# Altium schematic sheet power.SchDoc: BioGAP WULPUS-pro shield
size A3; DrawnBy: IIS; Revision: 1.0.0; SheetNumber: 7; SheetTotal: 8
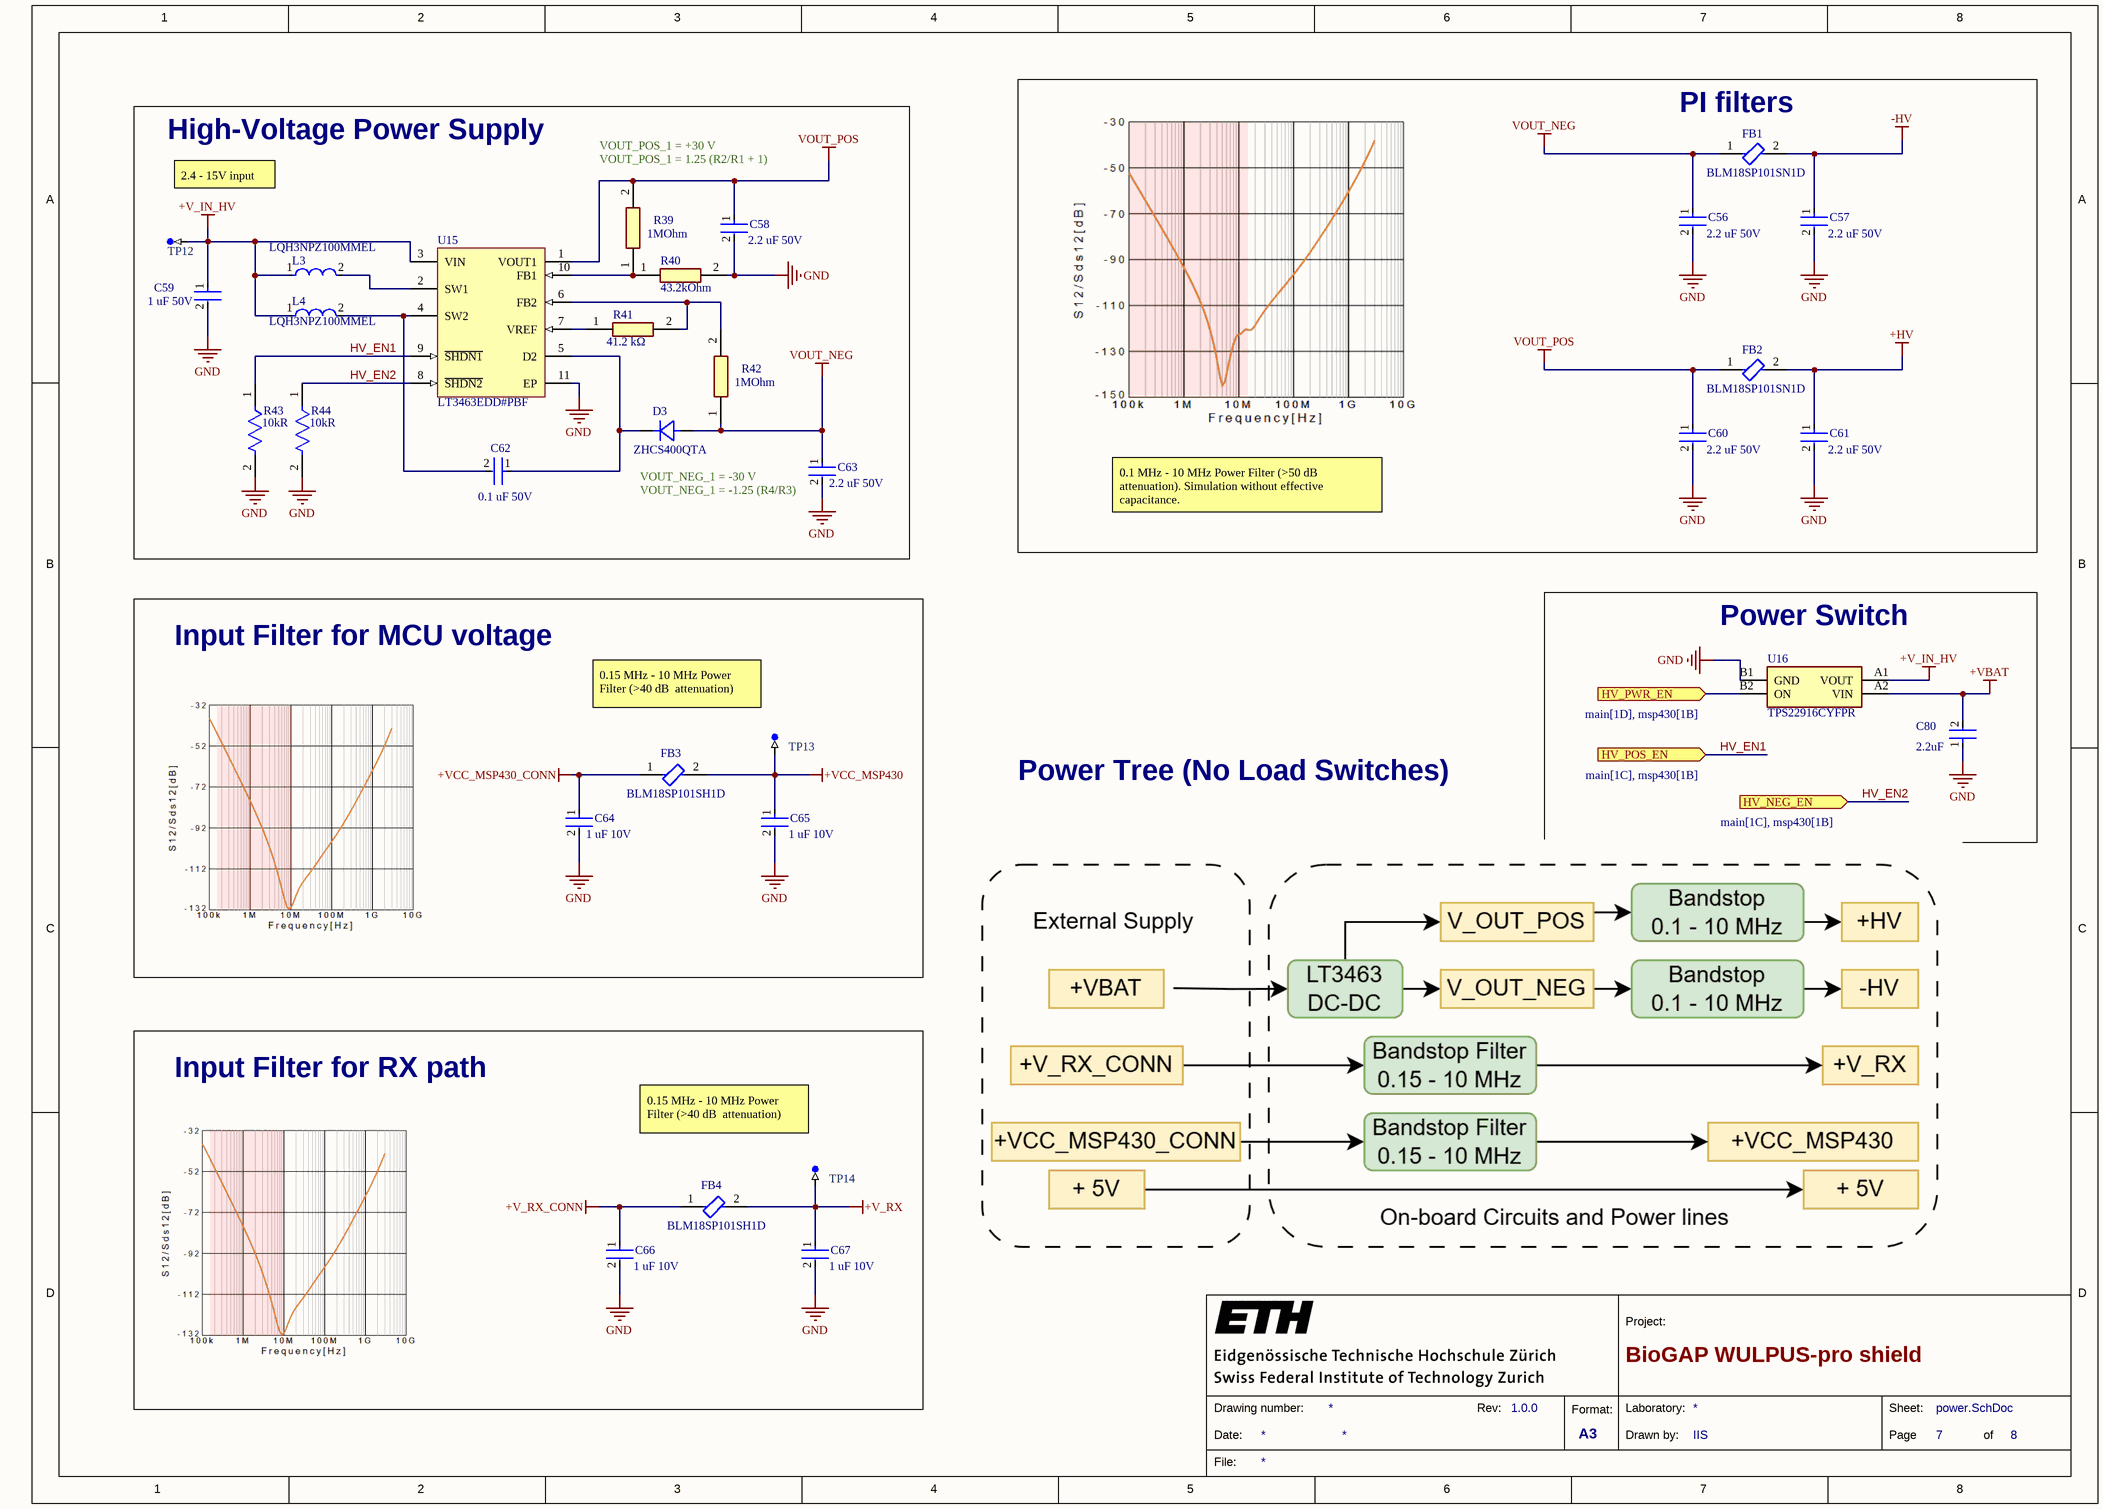
[diagram p0: power.SchDoc]

## Parts
C56  Capacitance: 2.2 uF 50V  [FP-GRM188-0_2-IPC_B]  (hidden comment: GRM188R61H225ME11D)
C57  Capacitance: 2.2 uF 50V  [FP-GRM188-0_2-IPC_B]  (hidden comment: GRM188R61H225ME11D)
C58  Capacitance: 2.2 uF 50V  [FP-GRM188-0_2-IPC_B]  (hidden comment: GRM188R61H225ME11D)
C59  Capacitance: 1 uF 50V  [FP-GCM21B-0_15-IPC_C]  (hidden comment: GCM21BR71H105KA03L)
C60  Capacitance: 2.2 uF 50V  [FP-GRM188-0_2-IPC_B]  (hidden comment: GRM188R61H225ME11D)
C61  Capacitance: 2.2 uF 50V  [FP-GRM188-0_2-IPC_B]  (hidden comment: GRM188R61H225ME11D)
C62  Capacitance: 0.1 uF 50V  [FP-GRM155-0_05-MFG]  (hidden comment: GRM155C71H104KE19D)
C63  Capacitance: 2.2 uF 50V  [FP-GRM188-0_2-IPC_B]  (hidden comment: GRM188R61H225ME11D)
C64  Cap: 1 uF 10V  [FP-GRM155-0_1-IPC_C]  (hidden comment: GRM155Z71A105KE01D)
C65  Cap: 1 uF 10V  [FP-GRM155-0_1-IPC_C]  (hidden comment: GRM155Z71A105KE01D)
C66  Cap: 1 uF 10V  [FP-GRM155-0_1-IPC_C]  (hidden comment: GRM155Z71A105KE01D)
C67  Cap: 1 uF 10V  [FP-GRM155-0_1-IPC_C]  (hidden comment: GRM155Z71A105KE01D)
C80  Capacitance: 2.2uF  [FP-C1005-050-0_15-0_1-MFG]  (hidden comment: C1005X7S1A225K050BC)
D3  ZHCS400QTA  [DIODE_SOD323_DIO]
FB1  BLM18SP101SN1D  [FP-BLM18-0_15-t0_8-MFG]
FB2  BLM18SP101SN1D  [FP-BLM18-0_15-t0_8-MFG]
FB3  BLM18SP101SH1D  [FP-BLM18-0_15-t0_8-MFG]
FB4  BLM18SP101SH1D  [FP-BLM18-0_15-t0_8-MFG]
L3  LQH3NPZ100MMEL  [FP-LQH3NPH_ME-MFG]
L4  LQH3NPZ100MMEL  [FP-LQH3NPH_ME-MFG]
R39  Resistance: 1MOhm  [ERJ2RKD1004X]  (hidden comment: ERJ-2RKF1004X)
R40  Resistance: 43.2kOhm  [ERJ2RKD1004X]  (hidden comment: ERJ-2RKF4322X)
R41  Resistance: 41.2 kΩ  [ERJ2RKD1004X]  (hidden comment: ERJ-2RKF4122X)
R42  Resistance: 1MOhm  [ERJ2RKD1004X]  (hidden comment: ERJ-2RKF1004X)
R43  Resistance: 10kR  [FP-CRCW0402-e3-IPC_B]  (hidden comment: CRCW040210K0JNED)
R44  Resistance: 10kR  [FP-CRCW0402-e3-IPC_B]  (hidden comment: CRCW040210K0JNED)
TP12  TP-SM-C-100  [TP-SM-C-100]  (value not drawn)  (no BOM)
TP13  TP-SM-C-100  [TP-SM-C-100]  (value not drawn)  (no BOM)
TP14  TP-SM-C-100  [TP-SM-C-100]  (value not drawn)  (no BOM)
U15  LT3463EDD#PBF  [LT-DD-10_V]
U16  TPS22916CYFPR  [BGA4C40P2X2_78X78X50]

## Blocks framed on the sheet
High-Voltage Power Supply: C58 C59 C62 C63 D3 L3 L4 R39-R44 TP12 U15
PI filters: C56 C57 C60 C61 FB1 FB2
Input Filter for MCU voltage: C64 C65 FB3 TP13
Power Switch: C80 U16
Input Filter for RX path: C66 C67 FB4 TP14

## Ports
HV_NEG_EN (in, see main[1C], msp430[1B]), HV_POS_EN (in, see main[1C], msp430[1B]), HV_PWR_EN (in, see main[1D], msp430[1B])

## Nets
+HV: C61.1 FB2.2
+V_IN_HV: C59.1 L3.1 L4.1 TP12.1 U15.3(VIN) U16.A1(VOUT)
+V_RX: C67.1 FB4.2 TP14.1
+V_RX_CONN: C66.1 FB4.1
+VBAT: C80.2 U16.A2(VIN)
+VCC_MSP430: C65.1 FB3.2 TP13.1
+VCC_MSP430_CONN: C64.1 FB3.1
-HV: C57.1 FB1.2
GND: C56.2 C57.2 C58.2 C59.2 C60.2 C61.2 C63.2 C64.2 C65.2 C66.2 C67.2 C80.1 R40.2 R43.2 R44.2 U15.11(EP) U16.B1(GND)
VOUT_NEG: C56.1 C63.1 D3.2 FB1.1 R42.1
VOUT_POS: C58.1 C60.1 FB2.1 R39.2 U15.1(VOUT1)
HV_EN1: R43.1 U15.9(~{SHDN1}) ; port HV_POS_EN
HV_EN2: R44.1 U15.8(~{SHDN2}) ; port HV_NEG_EN
HV_PWR_EN: U16.B2(ON) ; port HV_PWR_EN
NetC62_1: C62.1 D3.1 U15.5(D2)
NetC62_2: C62.2 L4.2 U15.4(SW2)
NetL3_2: L3.2 U15.2(SW1)
NetR39_1: R39.1 R40.1 U15.10(FB1)
NetR41_1: R41.1 U15.7(VREF)
NetR41_2: R41.2 R42.2 U15.6(FB2)

## Notes on the sheet
- 2.4 - 15V input
- VOUT_POS_1 = 1.25 (R2/R1 + 1)
- VOUT_POS_1 = +30 V
- (near C63) VOUT_NEG_1 = -1.25 (R4/R3)
- (near D3) VOUT_NEG_1 = -30 V
- 0.1 MHz - 10 MHz Power Filter (>50 dB  attenuation). Simulation without effective capacitance.
- (near TP13) 0.15 MHz - 10 MHz Power Filter (>40 dB  attenuation)
- Power Tree (No Load Switches)
- (near TP14) 0.15 MHz - 10 MHz Power Filter (>40 dB  attenuation)
- 1
- 2
- 3
- 4
- 5
- 6
- 7
- 8
- A
- B
- C
- D
- Project:
- Date:
- Drawing number:
- Rev:
- Format:
- A3
- Drawn by:
- Laboratory:
- Page
- Sheet:
- of
- File:

## Library data of the parts
C56-C58 C60 C61 C63 = CMP-06035-000704-1: Voltage Rating (DC): 50V; Dielectric: X5R; Tolerance: 20%; Weight: 0.000222oz; Min Operating Temperature: -55°C; Case Code (Imperial): 0603; Thickness: 0.039inch; Height: 0.8mm; Termination: SMD/SMT; Resistor Type: Ceramic; Case/Package: 0603; Package Quantity: 4000; Length: 0.063inch; Lead Free: Lead Free; Max Operating Temperature: 85°C; Packaging: Tape and Reel; Width: 0.031inch; Voltage Rating: 50V; Mount: Surface Mount; Case Code (Metric): 1608
C59 = CMP-2007-03354-2: Voltage Rating (DC): 50V; Dielectric: X7R; Tolerance: 10%; Min Operating Temperature: -55°C; Length: 2mm; Package Quantity: 3000; Case Code (Metric): 2012; Max Operating Temperature: 125°C; Termination: SMD/SMT; Thickness: 0.055inch; Ratings: AEC-Q200; Voltage Rating: 50V; Lead Free: Lead Free; Width: 0.049inch; Mount: Surface Mount; Case/Package: 0805; Case Code (Imperial): 0805; Radiation Hardening: No; Height: 1.25mm; Depth: 1.2mm; Packaging: Tape and Reel; Weight: 0.000335oz
C62 = CMP-06035-019038-1: Voltage Rating (DC): 50V; Dielectric: X7S; Tolerance: 10%; Width: 500um; Thickness: 500um; Length: 1mm
C64-C67 = CMP-06035-028020-1
C80 = CMP-08246-004344-1: Dielectric: X7S; Dielectric Material: Ceramic; Voltage Rating: 10V; Tolerance: 10%; Mount: Surface Mount; Height: 0.5mm; Package Quantity: 1; Depth: 0.5mm; RoHS Compliant: Yes; Length: 1mm; Thickness: 0.022inch; Packaging: Tape and Reel; Case Code (Imperial): 0402; Resistor Type: Ceramic; Case/Package: 0402; Min Operating Temperature: -55°C; Series: C; Weight: 2.3E-05oz; Width: 0.02inch; Voltage Rating (DC): 10V; Case Code (Metric): 1005; Max Operating Temperature: 125°C; Termination: SMD/SMT; Lead Free: Lead Free
D3 = ZHCS400QTA: Diode Schottky 40V 1A Automotive 2-Pin SOD-323 T/R; Manufacturer: Diodes; Supplier 1: Farnell; RoHS: Yes; Category: Rectifier Diodes; Stock 1: 385; Pricing 1: 5=0.87300, 10=0.73400, 100=0.49400, 500=0.38800 (CHF); Mount: Surface Mount; Packaging: Tape and Reel; Average Rectified Current: 1A; Max Reverse Voltage (DC): 40V; RoHS Compliant: Yes; ComponentLink1URL: http://www.mouser.com/ds/2/115/ZHCS400Q-959646.pdf?src-supplier=Mouser; ComponentLink1Description: http://www.mouser.com/ds/2/115/ZHCS400Q-959646.pdf?src-supplier=Mouser; Supplier Part Number 1: 3127490; Manufacturer Part Number: ZHCS400QTA
FB1 FB2 = CMP-00260-111572291-1: BLM18SP101SN1D Ferrite Bead, 100 Ohm, 3.7A, 0603 Rohs Compliant: Yes; Test Frequency: 100MHz; Tolerance: 25%; Series Resistance: 22mΩ; NexarPartId: 111572291; Lifecycle Status: Production; Core Material: Ferrite; Height: 950µm; Min Operating Temperature: -55°C; RMS Current (Irms): 3.7A; Resistance: 22mΩ; Max Operating Temperature: 125°C; Case/Package: 0603
FB3 FB4 = CMP-00260-111572290-1: BLM18SP101SH1D Ferrite Beads Multi-Layer 100Ohm 25% 100MHz 3.7A 0.022Ohm DCR 0603 Automotive T/R; Series Resistance: 22mΩ; Min Operating Temperature: -55°C; Test Frequency: 100MHz; Height: 950µm; NexarPartId: 111572290; Tolerance: 25%; Schedule B: 8504500000, 8504500000; Resistance: 22mΩ; Lifecycle Status: Production; Case/Package: 0603; Max Operating Temperature: 125°C; Core Material: Ferrite; RMS Current (Irms): 3.7A
L3 L4 = CMP-06042-007129-1: Wire Wound Ferrite Inductor for Power Lines For Automotive 10μH ±20% 0.228Ω 1280mA 1212; Self Resonant Frequency: 20MHz; Inductance: 10uH; Test Frequency: 1MHz; Shielding: Shielded; Saturation Current: 810mA; DC Resistance (DCR): 228mR; Current Rating: 1.28A; Case Code (Imperial): 1212; Case Code (Metric): 3030; Core Material: Ferrite; Resistor Type: Wirewound; Mount: Surface Mount; Ratings: AEC-Q200; Packaging: Cut Tape; Max Operating Temperature: 85°C; Tolerance: 20%; Min Operating Temperature: -40°C; Case/Package: 1212
R39 R42 = ERJ-2RKF1004X: Manufacturer_Name: Panasonic; Res: 1MOhm; Height: 0.4mm; Manufacturer_Part_Number: ERJ-2RKF1004X; Mouser Part Number: 667-ERJ-2RKF1004X; Mouser Price/Stock: https://www.mouser.co.uk/ProductDetail/Panasonic/ERJ-2RKF1004X?qs=H7k1u0Mp9JTG%252BclS6LVdqw%3D%3D; Arrow Part Number: ERJ-2RKF1004X; Arrow Price/Stock: https://www.arrow.com/en/products/erj-2rkf1004x/panasonic?region=nac
R40 = ERJ-2RKF4322X: Manufacturer_Name: Panasonic; Datasheet Link: https://industrial.panasonic.com/cdbs/www-data/pdf/RDA0000/AOA0000C86.pdf; Height: 0.4mm; Manufacturer_Part_Number: ERJ-2RKF4322X; Mouser Part Number: 667-ERJ-2RKF4322X; Mouser Price/Stock: http://www.mouser.com/Search/ProductDetail.aspx?qs=YMBIwoNQYdULE5GECeB%2fdA%3d%3d
R41 = ERJ-2RKF4122X: Manufacturer_Name: Panasonic; Datasheet Link: https://industrial.panasonic.com/cdbs/www-data/pdf/RDA0000/AOA0000C86.pdf; Height: 0.4mm; Manufacturer_Part_Number: ERJ-2RKF4122X; Mouser Part Number: 667-ERJ-2RKF4122X; Mouser Price/Stock: https://www.mouser.co.uk/ProductDetail/Panasonic/ERJ-2RKF4122X?qs=YMBIwoNQYdUCaGOKDy4kUA%3D%3D; Arrow Part Number: ERJ-2RKF4122X; Arrow Price/Stock: https://www.arrow.com/en/products/erj-2rkf4122x/panasonic?utm_currency=USD&region=nac
R43 R44 = CMP-2002-08136-3: Temperature Coefficient: 200ppm/°C; Voltage Rating: 50V; Power Rating: 63mW; Tolerance: 5%; Military Standard: Not; Packaging: Tape and Reel; Case Code (Imperial): 0402; Min Operating Temperature: -55°C; Case Code (Metric): 1005; Case/Package: 0402; Termination: SMD/SMT; Composition: Thick Film; Depth: 0.5mm; Number of Terminations: 2; Contact Plating: Tin; Height: 0.016inch; Width: 0.5mm; Max Operating Temperature: 155°C; Features: Automotive AEC-Q200; Length: 1mm; Radiation Hardening: No; Max Power Dissipation: 63mW; Mount: Surface Mount; Package Quantity: 1; Weight: 2.3E-05oz
TP12-TP14 = CMP-0484-00002-1: Test Point, Surface Mount, Circular, Pad Diameter 1 mm
U15 = CMP-0478-00030-1: Dual Micropower DC/DC Converters with Schottky Diodes, 2.4 to 15 V Vin, 10-pin SON (DD-10), -40 to 85 degC, Pb-Free; PartNumber: LT3463AEDD#PBF; Manufacturer: Linear Technology; Vin Max(V): 15; Number of Outputs: 2; Vin Min(V): 2.4; ComponentLink3URL: http://cds.linear.com/docs/en/packaging/DFN_10_05-08-1699.pdf; ComponentLink2URL: http://cds.linear.com/docs/en/datasheet/3463f.pdf; PackageReference: DD-10; PackageVersion: Rev. C, 06/2010; ComponentLink1URL: http://www.linear.com/; RoHS: TRUE; ComponentLink3Description: Package Specification; Mounting Technology: Surface Mount; Code_JEDEC: MO-229; ComponentLink2Description: Datasheet; PackageDescription: 10-Pin Plastic DFN, Body 3 x 3 mm, Pitch 0.5 mm; ComponentLink1Description: Manufacturer URL
U16 = TPS22916CYFPR: TPS22916 5.5-V, 2-A Ultra-Low Leakage Load Switch; Manufacturer_Name: Texas Instruments; Geometry.Height: 0.5mm; Manufacturer_Part_Number: TPS22916CYFPR; Arrow Part Number: TPS22916CYFPR; Arrow Price/Stock: https://www.arrow.com/en/products/tps22916cyfpr/texas-instruments?utm_currency=USD&region=nac; Datasheet Link: http://www.ti.com/lit/gpn/tps22916